# Altium schematic sheet Sheet1.SchDoc
size A3; SheetNumber: 1; SheetTotal: 1
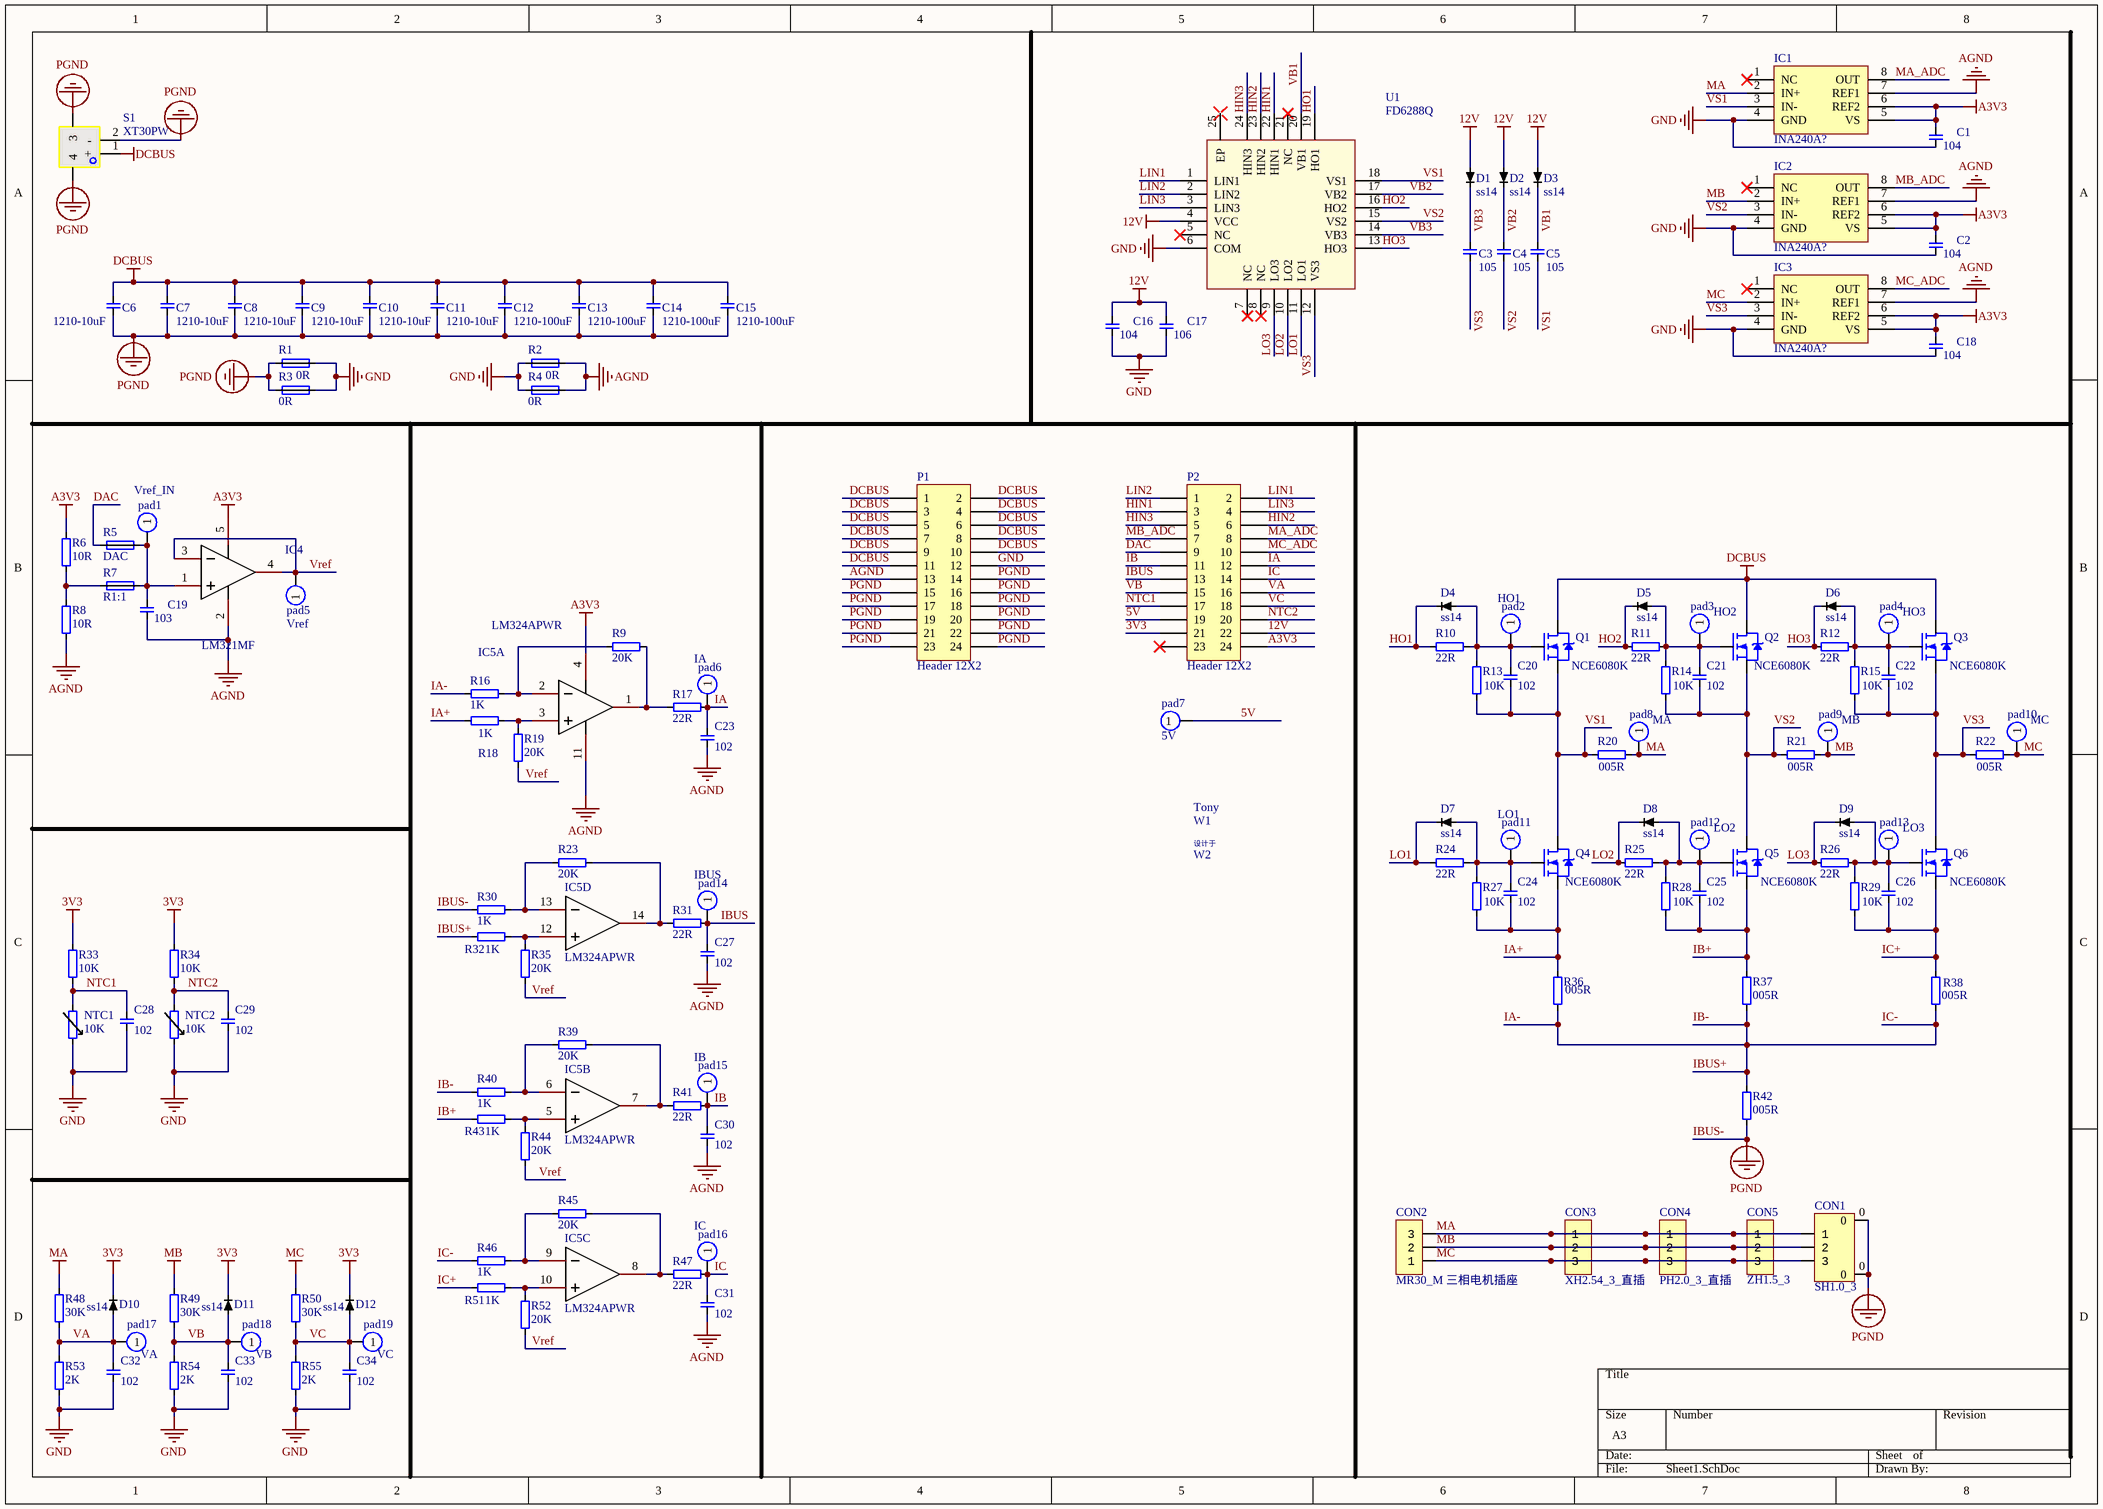
[diagram p0: Sheet1.SchDoc]

## Parts
C1  104  [CAP_0603]
C2  104  [CAP_0603]
C3  105  [CAP_0603]
C4  105  [CAP_0603]
C5  105  [CAP_0603]
C6  1210-10uF  [CAP_1210_L]
C7  1210-10uF  [CAP_1210_L]
C8  1210-10uF  [CAP_1210_L]
C9  1210-10uF  [CAP_1210_L]
C10  1210-10uF  [CAP_1210_L]
C11  1210-10uF  [CAP_1210_L]
C12  1210-100uF  [CAP_1210_L]
C13  1210-100uF  [CAP_1210_L]
C14  1210-100uF  [CAP_1210_L]
C15  1210-100uF  [CAP_1210_L]
C16  104  [CAP_0603]
C17  106  [CAP_0603]
C18  104  [CAP_0603]
C19  103  [CAP_0603]
C20  102  [CAP_0603]
C21  102  [CAP_0603]
C22  102  [CAP_0603]
C23  102  [CAP_0603]
C24  102  [CAP_0603]
C25  102  [CAP_0603]
C26  102  [CAP_0603]
C27  102  [CAP_0603]
C28  102  [CAP_0603]
C29  102  [CAP_0603]
C30  102  [CAP_0603]
C31  102  [CAP_0603]
C32  102  [CAP_0603]
C33  102  [CAP_0603]
C34  102  [CAP_0603]
CON1  SH1.0_3  [SH1.0 LS 3P]
CON2  MR30_M 三相电机插座  [MR30-M]
CON3  XH2.54_3_直插  [XH2.54-LI-3P]
CON4  PH2.0_3_直插  [PH2.0-LI-3P]
CON5  ZH1.5_3  [ZH1.5-LI-3P]
D1  ss14  [SOD-323]
D2  ss14  [SOD-323]
D3  ss14  [SOD-323]
D4  ss14  [SOD-323]
D5  ss14  [SOD-323]
D6  ss14  [SOD-323]
D7  ss14  [SOD-323]
D8  ss14  [SOD-323]
D9  ss14  [SOD-323]
D10  ss14  [SOD-323]
D11  ss14  [SOD-323]
D12  ss14  [SOD-323]
IC1  INA240A?  [TSSOP8]
IC2  INA240A?  [TSSOP8]
IC3  INA240A?  [TSSOP8]
IC4  LM321MF  [SOT23-5]
IC5  LM324APWR  [SOP14]  (parts A,B,C,D of 4)
NTC1  10K  [RES_0603]
NTC2  10K  [RES_0603]
P1  Header 12X2  [HDR2X12]
P2  Header 12X2  [HDR2X12]
pad1  Vref_IN  [PAD-1]
pad2  HO1  [PAD-1]
pad3  HO2  [PAD-1]
pad4  HO3  [PAD-1]
pad5  Vref  [PAD-1]
pad6  IA  [PAD-1]
pad7  5V  [PAD-1]
pad8  MA  [PAD-1]
pad9  MB  [PAD-1]
pad10  MC  [PAD-1]
pad11  LO1  [PAD-1]
pad12  LO2  [PAD-1]
pad13  LO3  [PAD-1]
pad14  IBUS  [PAD-1]
pad15  IB  [PAD-1]
pad16  IC  [PAD-1]
pad17  VA  [PAD-1]
pad18  VB  [PAD-1]
pad19  VC  [PAD-1]
Q1  NCE6080K  [TO252-2]
Q2  NCE6080K  [TO252-2]
Q3  NCE6080K  [TO252-2]
Q4  NCE6080K  [TO252-2]
Q5  NCE6080K  [TO252-2]
Q6  NCE6080K  [TO252-2]
R1  0R  [RES_0805-SHORT]
R2  0R  [RES_0805-SHORT]
R3  0R  [RES_0805-SHORT]
R4  0R  [RES_0805-SHORT]
R5  DAC  [RES_0603-SHORT]
R6  10R  [RES_0603]
R7  R1:1  [RES_0603-SHORT]
R8  10R  [RES_0603]
R9  20K  [RES_0603]
R10  22R  [RES_0603]
R11  22R  [RES_0603]
R12  22R  [RES_0603]
R13  10K  [RES_0603]
R14  10K  [RES_0603]
R15  10K  [RES_0603]
R16  1K  [RES_0603]
R17  22R  [RES_0603]
R18  1K  [RES_0603]
R19  20K  [RES_0603]
R20  005R  [RES_2512]
R21  005R  [RES_2512]
R22  005R  [RES_2512]
R23  20K  [RES_0603]
R24  22R  [RES_0603]
R25  22R  [RES_0603]
R26  22R  [RES_0603]
R27  10K  [RES_0603]
R28  10K  [RES_0603]
R29  10K  [RES_0603]
R30  1K  [RES_0603]
R31  22R  [RES_0603]
R32  1K  [RES_0603]
R33  10K  [RES_0603]
R34  10K  [RES_0603]
R35  20K  [RES_0603]
R36  005R  [RES_2512]
R37  005R  [RES_2512]
R38  005R  [RES_2512]
R39  20K  [RES_0603]
R40  1K  [RES_0603]
R41  22R  [RES_0603]
R42  005R  [RES_2512]
R43  1K  [RES_0603]
R44  20K  [RES_0603]
R45  20K  [RES_0603]
R46  1K  [RES_0603]
R47  22R  [RES_0603]
R48  30K  [RES_0603]
R49  30K  [RES_0603]
R50  30K  [RES_0603]
R51  1K  [RES_0603]
R52  20K  [RES_0603]
R53  2K  [RES_0603]
R54  2K  [RES_0603]
R55  2K  [RES_0603]
S1  XT30PW  [XT30PW-M]
U1  FD6288Q  [QFN-24_4X4]
W1  Tony  [Tony_2(200-70)]  (value not drawn)
W2  设计于  [designed by（430-70）]  (value not drawn)

## Nets
3V3: D10.2 D11.2 D12.2 P2.21 R33.1 R34.1
12V: C16.2 C17.2 D1.1 D2.1 D3.1 P2.22 U1.4(VCC)
A3V3: C1.2 C2.2 C18.2 IC1.5(VS) IC1.6(REF2) IC2.5(VS) IC2.6(REF2) IC3.5(VS) IC3.6(REF2) IC4.5(V+) IC5.4(VCC+) P2.24 R6.1
AGND: C19.1 C23.1 C27.1 C30.1 C31.1 IC1.7(REF1) IC2.7(REF1) IC3.7(REF1) IC4.2(V-) IC5.11(VCC-) P1.13 R2.2 R4.2 R8.2
DCBUS: C6.2 C7.2 C8.2 C9.2 C10.2 C11.2 C12.2 C13.2 C14.2 C15.2 P1.1 P1.2 P1.3 P1.4 P1.5 P1.6 P1.7 P1.8 P1.9 P1.10 P1.11 Q1.2(D) Q2.2(D) Q3.2(D) S1.1(+)
GND: C1.1 C2.1 C16.1 C17.1 C18.1 C28.1 C29.1 C32.1 C33.1 C34.1 IC1.4(GND) IC2.4(GND) IC3.4(GND) NTC1.2 NTC2.2 P1.12 R1.2 R2.1 R3.2 R4.1 R53.2 R54.2 R55.2 U1.6(COM)
IBUS-: C6.1 C7.1 C8.1 C9.1 C10.1 C11.1 C12.1 C13.1 C14.1 C15.1 CON1.0 P1.14 P1.15 P1.16 P1.17 P1.18 P1.19 P1.20 P1.21 P1.22 P1.23 P1.24 R1.1 R3.1 R30.1 R42.1 S1.2(-) S1.3 S1.4  [also labelled PGND]
MA: CON1.1 CON2.3 CON3.1 CON4.1 CON5.1 IC1.2(IN+) pad8.1 R20.2 R48.1
MB: CON1.2 CON2.2 CON3.2 CON4.2 CON5.2 IC2.2(IN+) pad9.1 R21.2 R49.1
MC: CON1.3 CON2.1 CON3.3 CON4.3 CON5.3 IC3.2(IN+) pad10.1 R22.2 R50.1
5V: P2.19 pad7.1
DAC: P2.9 R5.1
HIN1: P2.3 U1.22(HIN1)
HIN2: P2.6 U1.23(HIN2)
HIN3: P2.5 U1.24(HIN3)
HO1: D4.2 R10.2 U1.19(HO1)
HO2: D5.2 R11.2 U1.16(HO2)
HO3: D6.2 R12.2 U1.13(HO3)
IA: C23.2 P2.12 pad6.1 R17.2
IA+: C24.1 Q4.3(S) R18.1 R27.2 R36.2
IA-: R16.1 R32.1 R36.1 R37.1 R38.1 R40.1 R42.2 R46.1  [also labelled IB-, IBUS+, IC-]
IB: C30.2 P2.11 pad15.1 R41.2
IB+: C25.1 Q5.3(S) R28.2 R37.2 R43.1
IBUS: C27.2 P2.13 pad14.1 R31.2
IC: C31.2 P2.14 pad16.1 R47.2
IC+: C26.1 Q6.3(S) R29.2 R38.2 R51.1
LIN1: P2.2 U1.1(LIN1)
LIN2: P2.1 U1.2(LIN2)
LIN3: P2.4 U1.3(LIN3)
LO1: D7.2 R24.2 U1.11(LO1)
LO2: D8.2 R25.2 U1.10(LO2)
LO3: D9.2 R26.2 U1.9(LO3)
MA_ADC: IC1.8(OUT) P2.8
MB_ADC: IC2.8(OUT) P2.7
MC_ADC: IC3.8(OUT) P2.10
NTC1: C28.2 NTC1.1 P2.17 R33.2
NTC2: C29.2 NTC2.1 P2.20 R34.2
VA: C32.2 D10.1 P2.16 pad17.1 R48.2 R53.1
VB: C33.2 D11.1 P2.15 pad18.1 R49.2 R54.1
VB1: C5.2 D3.2 U1.20(VB1)
VB2: C4.2 D2.2 U1.17(VB2)
VB3: C3.2 D1.2 U1.14(VB3)
VC: C34.2 D12.1 P2.18 pad19.1 R50.2 R55.1
Vref: IC4.3(IN-) IC4.4(OUT) pad5.1 R19.1 R35.1 R44.1 R52.1
VS1: C5.1 C20.1 IC1.3(IN-) Q1.3(S) Q4.2(D) R13.2 R20.1 U1.18(VS1)
VS2: C4.1 C21.1 IC2.3(IN-) Q2.3(S) Q5.2(D) R14.2 R21.1 U1.15(VS2)
VS3: C3.1 C22.1 IC3.3(IN-) Q3.3(S) Q6.2(D) R15.2 R22.1 U1.12(VS3)
NetC19_2: C19.2 IC4.1(IN+) pad1.1 R5.2 R7.2
NetC20_2: C20.2 D4.1 pad2.1 Q1.1(G) R10.1 R13.1
NetC21_2: C21.2 D5.1 pad3.1 Q2.1(G) R11.1 R14.1
NetC22_2: C22.2 D6.1 pad4.1 Q3.1(G) R12.1 R15.1
NetC24_2: C24.2 D7.1 pad11.1 Q4.1(G) R24.1 R27.1
NetC25_2: C25.2 D8.1 pad12.1 Q5.1(G) R25.1 R28.1
NetC26_2: C26.2 D9.1 pad13.1 Q6.1(G) R26.1 R29.1
NetIC5_1: IC5.1(OUT1) R9.2 R17.1
NetIC5_2: IC5.2(IN1-) R9.1 R16.2
NetIC5_3: IC5.3(IN1+) R18.2 R19.2
NetIC5_5: IC5.5(IN2+) R43.2 R44.2
NetIC5_6: IC5.6(IN2-) R39.1 R40.2
NetIC5_7: IC5.7(OUT2) R39.2 R41.1
NetIC5_8: IC5.8(OUT3) R45.2 R47.1
NetIC5_9: IC5.9(IN3-) R45.1 R46.2
NetIC5_10: IC5.10(IN3+) R51.2 R52.2
NetIC5_12: IC5.12(IN4+) R32.2 R35.2
NetIC5_13: IC5.13(IN4-) R23.1 R30.2
NetIC5_14: IC5.14(OUT4) R23.2 R31.1
NetR6_2: R6.2 R7.1 R8.1

Not connected (* = marked no-connect by the designer): IC1 1(NC)*; IC2 1(NC)*; IC3 1(NC)*; P2 23*; U1 5(NC)* 7(NC)* 8(NC)* 21(NC)* 25(EP)

## Library data of the parts
C1-C34 = cap
CON1 = SH1.0_3: SH1.0 座子
CON2 = MR30_M: 三相电机线插座
CON3 = XH2.54_3_L: XH2.54_3 直插 座子
CON4 = PH2.0_3_L: PH2.0_3 直插 座子
CON5 = ZH1.5_3_L: ZH1.5_3 座子
D1-D12 = Diode
IC1-IC3 = INA240: 电流采样芯片 / A1=20 A2=50 A3=100 A4=200; BOM名称: 双通道运放-电流采样芯片
IC4 = LM321MF: 单通道运放; Manufacturer: TI(德州仪器); Name: LM321MF/NOPB; Add into BOM: yes; Number of Circuits: 1; Symbol: LM321MF/NOPB; Device: LM321MF/NOPB; LCSC Part Name: LM321MF/NOPB; Supplier Part: C131103; Manufacturer Part: LM321MF/NOPB; Supplier Footprint: SOT-23-5; JLCPCB Part Class: ExtendedPart; Datasheet: https://atta.szlcsc.com/upload/public/pdf/source/20180528/C131103_48811F2B458DDCB2A659958D3ACA9936.pdf; Supplier: LCSC; Convert to PCB: yes
IC5 = LM324APWR: 四通道运放; Manufacturer: TL084CPWR; Device: TI; Convert to PCB: yes; Origin Footprint: TSSOP-14_L5.0-W4.4-P0.65-LS6.4-BL; Symbol: LM324APWR; Supplier Part: C85344; Supplier: LCSC; Manufacturer Part: TI; JLCPCB Part Class: Extended Part; Add into BOM: yes; Name: LM324APWR
NTC1 NTC2 = NTC: 温敏电阻
P1 P2 = Header 12X2: Header, 12-Pin, Dual row; LatestRevisionDate: 17-Jul-2002; LatestRevisionNote: Re-released for DXP Platform.; Publisher: Altium Limited
pad1-pad19 = PAD: 50mil单点焊盘，用于测试
Q1-Q6 = NMOS: N沟道MOSFIT / -NCE6080K-TO252-2
R1-R5 R7 = Res-SHORT
R6 R8-R55 = Res
S1 = XT30PW: XT30PW-I/O
U1 = FD6288Q: 栅极驱动IC